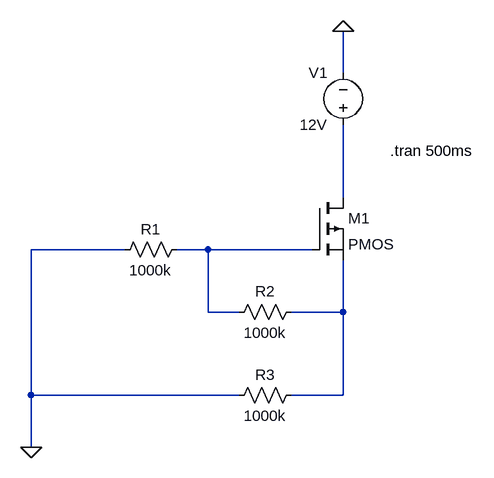
[diagram p0: schematic PMOS防反接.asc]
PMOS防反接.asc, the LTspice schematic file:
Version 4.1
SHEET 1 880 680
WIRE 208 -80 208 -144
WIRE 208 112 208 0
WIRE -128 192 -272 192
WIRE 0 192 -48 192
WIRE 160 192 0 192
WIRE 0 288 0 192
WIRE 48 288 0 288
WIRE 208 288 208 208
WIRE 208 288 128 288
WIRE -272 416 -272 192
WIRE 48 416 -272 416
WIRE 208 416 208 288
WIRE 208 416 128 416
WIRE -272 496 -272 416
FLAG -272 496 0
FLAG 208 -144 0
SYMBOL pmos 160 112 R0
SYMATTR InstName M1
SYMBOL res -32 176 R90
WINDOW 0 0 56 VBottom 2
WINDOW 3 32 56 VTop 2
SYMATTR InstName R1
SYMATTR Value 1000k
SYMBOL res 144 272 R90
WINDOW 0 0 56 VBottom 2
WINDOW 3 32 56 VTop 2
SYMATTR InstName R2
SYMATTR Value 1000k
SYMBOL res 144 400 R90
WINDOW 0 0 56 VBottom 2
WINDOW 3 32 56 VTop 2
SYMATTR InstName R3
SYMATTR Value 1000k
SYMBOL voltage 208 16 R180
WINDOW 0 24 96 Left 2
WINDOW 3 24 16 Left 2
WINDOW 123 0 0 Left 0
WINDOW 39 0 0 Left 0
SYMATTR InstName V1
SYMATTR Value 12V
TEXT 280 40 Left 2 !.tran 500ms

The netlist it stands for:
* PMOS防反接.asc
M1 N001 N002 N003 N003 PMOS
R1 N002 0 1000k
R2 N003 N002 1000k
R3 N003 0 1000k
V1 N001 0 12V
.model NMOS NMOS
.model PMOS PMOS
.lib standard.mos
.tran 500ms
.backanno
.end